# EasyEDA Pro project 轮足机器人主板&核心板.epro, board 卡座主板PCB
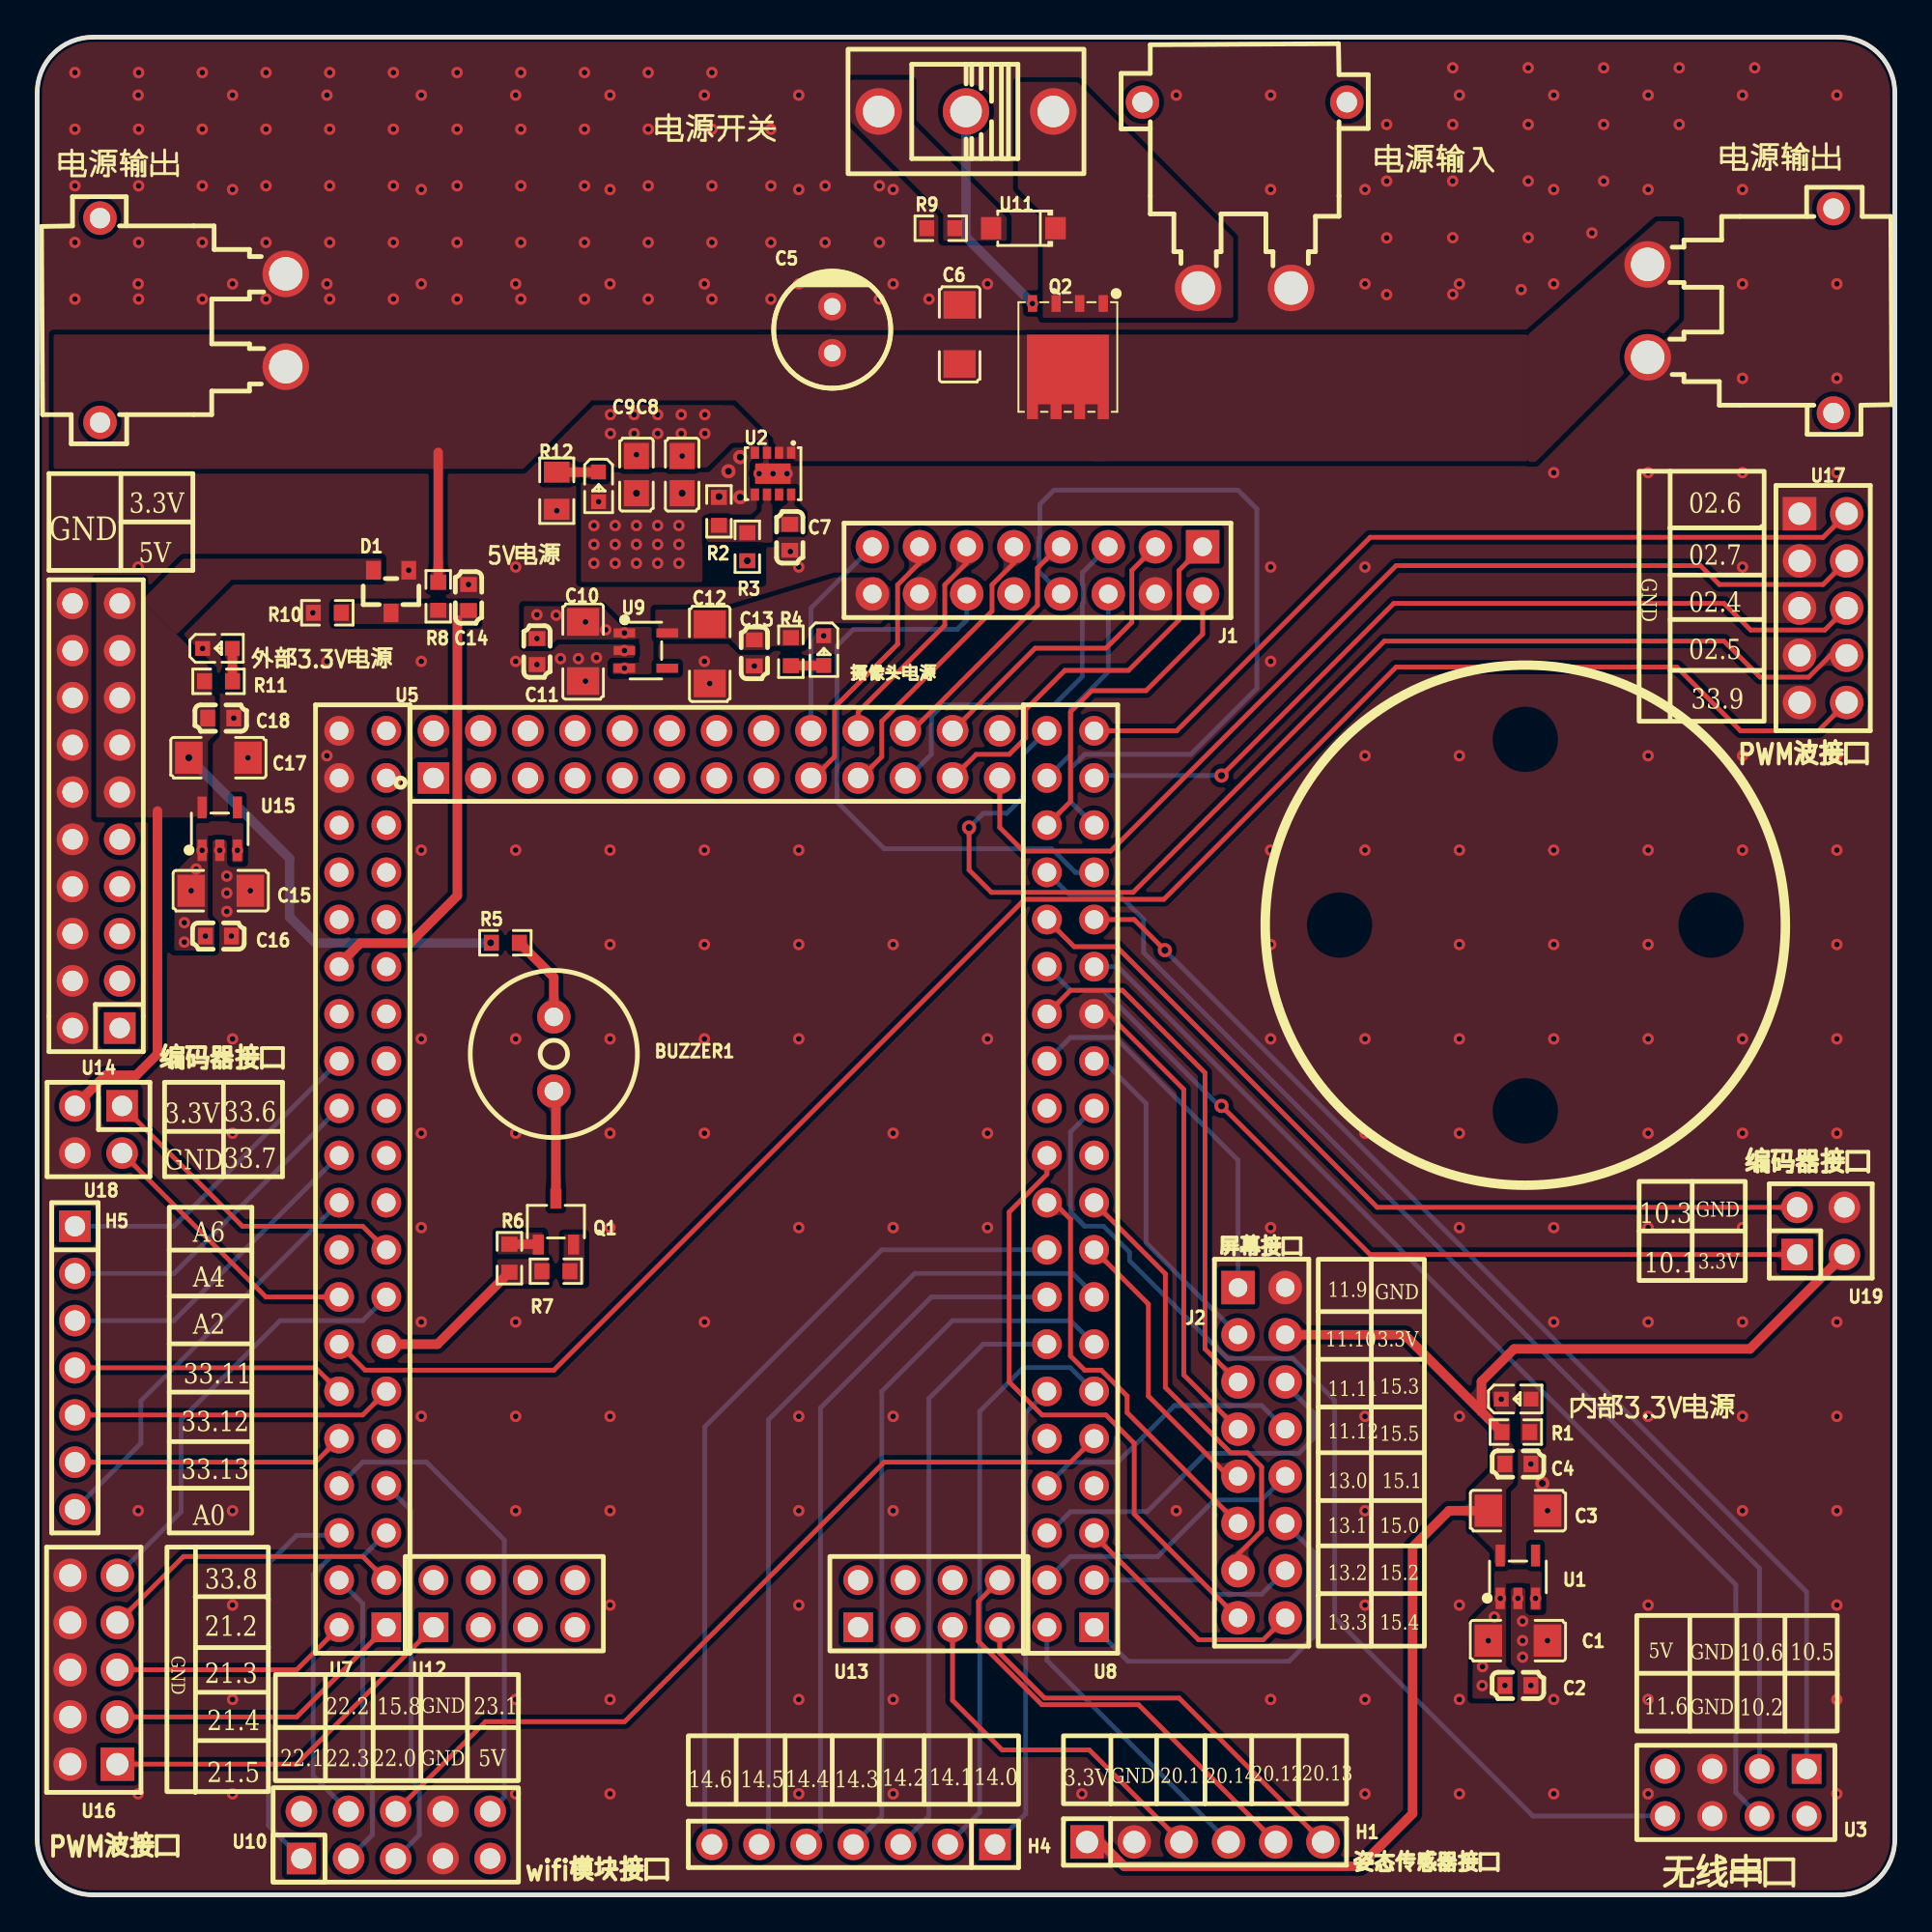
[diagram p13: board, top side]
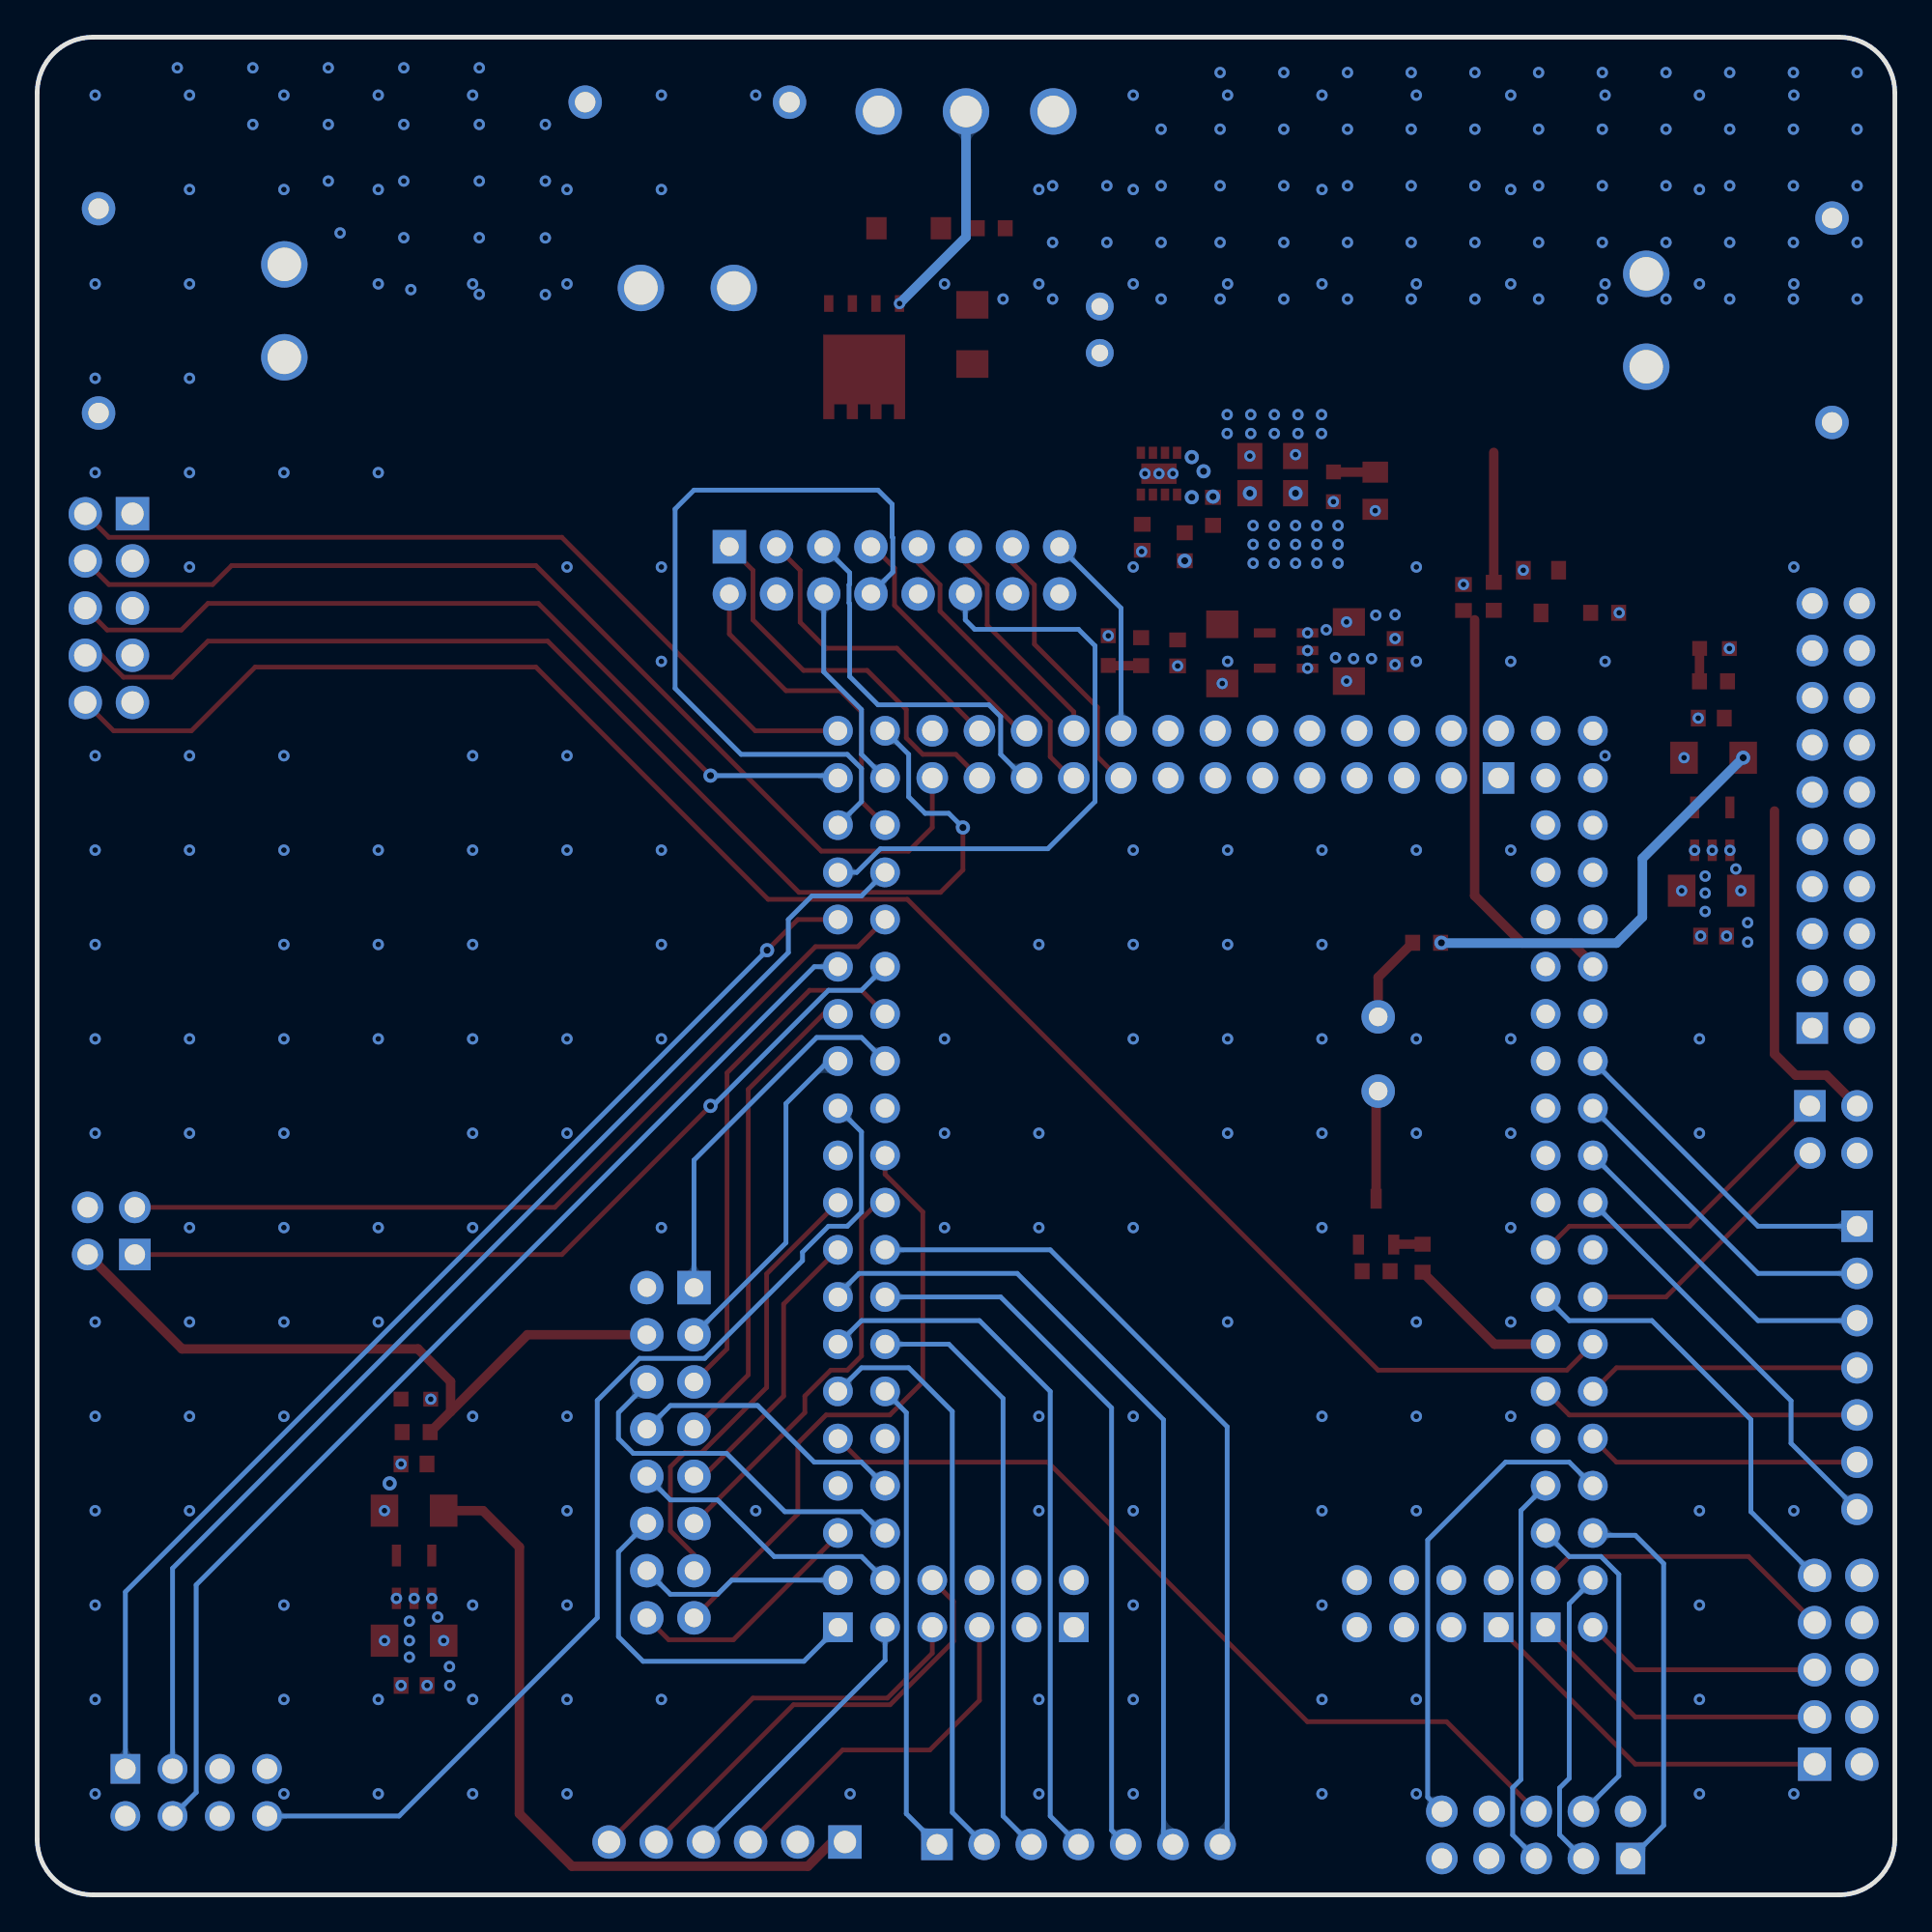
[diagram p14: board, bottom side, seen from below]

Outline 100 x 100 mm; copper layers: Top Layer, Inner1, Inner2, Bottom Layer. Coordinates in mm from the lower left corner of the outline.
Outline path: 0,97 0,3 arc(0.88,0.88) 3,0 97,0 arc(99.12,0.88) 100,3 100,97 arc(99.12,99.12) 97,100 3,100 arc(0.88,99.12) 0,97
Stack: Top Layer 0.035mm 外层铜厚1oz / Dielectric1 0.2104mm 7628 RC49% 8.6mil / Inner1 0.0152mm 内层铜厚 / Dielectric2 1.065mm 1.1mm H/HOZ Copper / Inner2 0.0152mm 内层铜厚 / Dielectric3 0.2104mm 7628 RC49% 8.6mil / Bottom Layer 0.035mm 外层铜厚1oz

## Design rules (mm)
template: 自定义配置
spacing copperThickness1oz (default): track to track 0.102, other pairs 0.152 to 0.3
spacing copperThickness2oz: track to track 0.203, other pairs 0.152 to 0.3
track width copperThickness1oz (default): min 0.127, default 0.254, max 2.54
track width copperThickness2oz: min 0.203, default 0.254, max 2.54
differential pair differentialPair (default): width min 0.127, default 0.254, max 2.54; gap min 0.152, default 0.152
via viaSize (default): diameter min 0.5, default 0.61, max 10; hole min 0.3, default 0.305, max 6.3
net GND uses copperRegion1, innerPlane1
net VIN_BAT uses copperRegion1
net $1N441 uses copperRegion1
net +5V uses copperRegion1, innerPlane1
net VCC3V3 uses copperRegion1
net VCCCAM uses copperRegion1
net $1N1315 uses copperRegion1
net DCIN uses copperRegion1
net $1N1940 uses copperRegion1
net $1N622 uses copperRegion1
net $1N1939 uses copperRegion1
net $1N4417 uses copperRegion1
net $1N4409 uses copperRegion1
net A11 uses copperRegion1
net 33.10 uses copperRegion1
net VCC3V3OUT uses copperRegion1

## Placement (name value [footprint] x y rotation side)
5V电源  -  [LED_0603]  30.23 75.74 270 top
BUZZER1  2.7kHz  [BUZ-TH_BD9.0-P4.00-D0.6-FD]  27.81 45.26 270 top
C1  10uF  [C1206]  79.71 13.68 180 top
C2  100nF  [C0603]  79.71 11.27 180 top
C3  10uF  [C1206]  79.71 20.68 180 top
C4  100nF  [C0603]  79.71 23.19 180 top
C5  150uF  [CAP-TH_BD6.3-P2.50-D0.5-FD]  42.8 84.25 90 top
C6  10uF  [C1206]  49.66 84 270 top
C7  3.3nF  [C0603]  40.51 73.08 90 top
C8  22uF  [C0805]  32.26 76.45 90 top
C9  22uF  [C0805]  34.72 76.45 90 top
C10  10uF  [C1206]  29.39 66.93 90 top
C11  100nF  [C0603]  26.9 66.93 90 top
C12  10uF  [C1206]  36.21 66.8 90 top
C13  100nF  [C0603]  38.61 66.85 90 top
C14  100nF  [C0603]  23.22 69.84 270 top
C15  10uF  [C1206]  9.88 54.05 180 top
C16  100nF  [C0603]  9.76 51.61 180 top
C17  10uF  [C1206]  9.76 61.21 180 top
C18  100nF  [C0603]  9.88 63.34 180 top
D1  BAV99  [SOT-23_L2.9-W1.3-P1.90-LS2.4-BR]  19.05 70.16 90 top
H1  2.54-1x6P直针  [HDR-TH_6P-P2.54-V-M-1]  62.87 2.84 0 top
H4  PZ254V-11-07P  [HDR-TH_7P-P2.54-V-M]  43.94 2.72 180 top
H5  PZ254V-11-07P  [HDR-TH_7P-P2.54-V-M]  2.03 28.37 270 top
J1  2.54-2*8P母  [HDR-TH_16P-P2.54-V-F-R2-C8-S2.54]  53.85 71.3 180 top
J2  2.54-2*8P母  [HDR-TH_16P-P2.54-V-F-R2-C8-S2.54]  65.91 23.8 270 top
Q1  S8050  [SOT-23-3_L2.9-W1.6-P1.90-LS2.8-BR]  27.92 36.24 270 top
Q2  AGM60P100A  [TDSON-8_L5.9-W5.2-P1.27-BL]  55.48 83.89 180 top
R1  2.7k  [R0603]  79.6 24.91 180 top
R2  523kΩ  [R0603]  36.7 74.47 90 top
R3  100kΩ  [R0603]  38.23 72.57 90 top
R4  2.7k  [R0603]  40.57 66.92 90 top
R5  10Ω  [R0603]  25.2 51.25 0 top
R6  4.7kΩ  [R0603]  25.42 34.27 90 top
R7  10K  [R0603]  27.92 33.57 0 top
R8  200k  [R0603]  21.59 69.9 90 top
R9  10k  [R0603]  48.64 89.71 0 top
R10  22k  [R0603]  15.62 69.01 0 top
R11  2.7k  [R0603]  9.76 65.32 180 top
R12  4.7kΩ  [R0805]  27.97 75.58 270 top
U1  RT9013-33GB  [SOT-23-5_L3.0-W1.7-P0.95-LS2.8-BL]  79.71 17.11 0 top
U2  TPS82130SILR  [USIP-8_L3.0-W2.8-P0.65-TL-EP]  39.61 76.5 270 top
U3  2541FV-2x4P  [HDR-TH_8P-P2.54-V-F-R2-C4-S2.54]  91.44 5.51 180 top
U5  PM254-2-13-Z-8.5  [HDR-TH_26P-P2.54-V-F-R2-C13-S2.54-1]  36.58 61.39 0 top
U7  PM254-2-20-Z-8.5  [HDR-TH_40P-P2.54-V-F-R2-C20-S2.54]  17.53 38.53 90 top
U8  PM254-2-20-Z-8.5  [HDR-TH_40P-P2.54-V-F-R2-C20-S2.54]  55.63 38.53 90 top
U9  RT9013-33GB  [SOT-23-5_L3.0-W1.7-P0.95-LS2.8-BL]  32.77 66.98 270 top
U10  2541FV-2x5P  [HDR-TH_10P-P2.54-V-F-R2-C5-S2.54]  19.3 3.23 0 top
U11  BZT52C16  [SOD-123_L2.7-W1.6-LS3.8-RD]  53.09 89.71 180 top
U12  PM254-2-04-Z-8.5  [HDR-TH_8P-P2.54-V-F-R2-C4-S2.54]  25.15 15.67 0 top
U13  PM254-2-04-Z-8.5  [HDR-TH_8P-P2.54-V-F-R2-C4-S2.54]  48.01 15.67 0 top
U14  2541WV-2x10P  [HDR-TH_20P-P2.54-V-M-R2-C10-S2.54]  3.17 58.09 90 top
U15  RT9013-33GB  [SOT-23-5_L3.0-W1.7-P0.95-LS2.8-BL]  9.83 57.38 0 top
U16  A2541WV-2x5P  [HDR-TH_10P-P2.54-V-M-R2-C5-S2.54-1]  3.05 12.12 90 top
U17  A2541WV-2x5P  [HDR-TH_10P-P2.54-V-M-R2-C5-S2.54-1]  96.14 69.27 270 top
U18  KH-2.54PH180-2X2P-L11.5  [HDR-TH_4P-P2.54-V-M-R2-C2-S2.54]  3.3 41.2 180 top
U19  KH-2.54PH180-2X2P-L11.5  [HDR-TH_4P-P2.54-V-M-R2-C2-S2.54]  96.01 35.74 0 top
内部3.3V电源  -  [LED_0603]  79.66 26.69 0 top
外部3.3V电源  -  [LED_0603]  9.76 67.1 0 top
摄像头电源  -  [LED_0603]  42.35 66.93 270 top
电源开关  SS-12D10L3  [SW-TH_SS-12D10L3]  50 96 180 top
电源输入  XT30PW-M30.G.Y  [CONN-TH_XT30PW-M]  65 91.5 180 top
电源输出  -  [CONN-TH_XT30PW-M]  8.38 84.76 270 top
电源输出#2  -  [CONN-TH_XT30PW-M]  91.69 85.27 90 top

## Footprints (pads in the part's own frame, mm; a bottom-side part is the same pattern mirrored in y, then rotated)
BUZ-TH_BD9.0-P4.00-D0.6-FD
  round 1.8 hole 1: 1(-2,0) 2(2,0)
C0603
  rect 0.8x0.9 smd: 1(-0.7,0) 2(0.7,0)
C0805
  rect 1.41x1.35 smd: 1(-1,0) 2(1,0)
C1206
  rect 1.485x1.728 smd: 1(-1.593,0) 2(1.593,0)
CAP-TH_BD6.3-P2.50-D0.5-FD
  round 1.5 hole 0.9: 1(-1.25,0) 2(1.25,0)
CONN-TH_XT30PW-M
  round 2.5 hole 1.8: 1(-2.5,5) 2(2.5,5)
  round 1.8 hole 1.1: 3(5.5,-5) 4(-5.5,-5)
HDR-TH_4P-P2.54-V-M-R2-C2-S2.54
  rect 1.7x1.7 hole 1.1: 1(-1.27,-1.27)
  round 1.7 hole 1.1: 2(-1.27,1.27) 3(1.27,-1.27) 4(1.27,1.27)
HDR-TH_6P-P2.54-V-M-1
  rect 1.8x1.8 hole 1.2: 1(-6.35,0)
  round 1.8 hole 1.2: 2(-3.81,0) 3(-1.27,0) 4(1.27,0) 5(3.81,0) 6(6.35,0)
HDR-TH_7P-P2.54-V-M
  rect 1.7x1.7 hole 1.1: 1(-7.62,0)
  round 1.7 hole 1.1: 2(-5.08,0) 3(-2.54,0) 4(0,0) 5(2.54,0) 6(5.08,0) 7(7.62,0)
HDR-TH_8P-P2.54-V-F-R2-C4-S2.54
  rect 1.6x1.6 hole 1.1: 1(-3.81,-1.27)
  round 1.6 hole 1.1: 2(-3.81,1.27) 3(-1.27,-1.27) 4(-1.27,1.27) 5(1.27,-1.27) 6(1.27,1.27) 7(3.81,-1.27) 8(3.81,1.27)
HDR-TH_10P-P2.54-V-F-R2-C5-S2.54
  rect 1.575x1.7 hole 1.1: 1(-5.08,-1.27)
  round 1.7 hole 1.1: 2(-5.08,1.27) 3(-2.54,-1.27) 4(-2.54,1.27) 5(0,-1.27) 6(0,1.27) 7(2.54,-1.27) 8(2.54,1.27) 9(5.08,-1.27) 10(5.08,1.27)
HDR-TH_10P-P2.54-V-M-R2-C5-S2.54-1
  rect 1.8x1.8 hole 1.2: 1(-5.08,-1.27)
  round 1.8 hole 1.2: 2(-5.08,1.27) 3(-2.54,-1.27) 4(-2.54,1.27) 5(0,-1.27) 6(0,1.27) 7(2.54,-1.27) 8(2.54,1.27) 9(5.08,-1.27) 10(5.08,1.27)
HDR-TH_16P-P2.54-V-F-R2-C8-S2.54
  rect 1.8x1.8 hole 1: 1(-8.89,-1.27)
  round 1.8 hole 1: 2(-8.89,1.27) 3(-6.35,-1.27) 4(-6.35,1.27) 5(-3.81,-1.27) 6(-3.81,1.27) 7(-1.27,-1.27) 8(-1.27,1.27) 9(1.27,-1.27) 10(1.27,1.27) 11(3.81,-1.27) 12(3.81,1.27) 13(6.35,-1.27) 14(6.35,1.27) 15(8.89,-1.27) 16(8.89,1.27)
HDR-TH_20P-P2.54-V-M-R2-C10-S2.54
  rect 1.7x1.7 hole 1.1: 1(-11.43,-1.27)
  round 1.7 hole 1.1: 2(-11.43,1.27) 3(-8.89,-1.27) 4(-8.89,1.27) 5(-6.35,-1.27) 6(-6.35,1.27) 7(-3.81,-1.27) 8(-3.81,1.27) 9(-1.27,-1.27) 10(-1.27,1.27) 11(1.27,-1.27) 12(1.27,1.27) 13(3.81,-1.27) 14(3.81,1.27) 15(6.35,-1.27) 16(6.35,1.27) 17(8.89,-1.27) 18(8.89,1.27) 19(11.43,-1.27) 20(11.43,1.27)
HDR-TH_26P-P2.54-V-F-R2-C13-S2.54-1
  rect 1.7x1.7 hole 1.1: 1(-15.24,-1.27)
  round 1.7 hole 1.1: 2(-15.24,1.27) 3(-12.7,-1.27) 4(-12.7,1.27) 5(-10.16,-1.27) 6(-10.16,1.27) 7(-7.62,-1.27) 8(-7.62,1.27) 9(-5.08,-1.27) 10(-5.08,1.27) 11(-2.54,-1.27) 12(-2.54,1.27) 13(0,-1.27) 14(0,1.27) 15(2.54,-1.27) 16(2.54,1.27) 17(5.08,-1.27) 18(5.08,1.27) 19(7.62,-1.27) 20(7.62,1.27) 21(10.16,-1.27) 22(10.16,1.27) 23(12.7,-1.27) 24(12.7,1.27) 25(15.24,-1.27) 26(15.24,1.27)
HDR-TH_40P-P2.54-V-F-R2-C20-S2.54
  rect 1.6x1.6 hole 1: 1(-24.13,-1.27)
  round 1.6 hole 1: 2(-24.13,1.27) 3(-21.59,-1.27) 4(-21.59,1.27) 5(-19.05,-1.27) 6(-19.05,1.27) 7(-16.51,-1.27) 8(-16.51,1.27) 9(-13.97,-1.27) 10(-13.97,1.27) 11(-11.43,-1.27) 12(-11.43,1.27) 13(-8.89,-1.27) 14(-8.89,1.27) 15(-6.35,-1.27) 16(-6.35,1.27) 17(-3.81,-1.27) 18(-3.81,1.27) 19(-1.27,-1.27) 20(-1.27,1.27) 21(1.27,-1.27) 22(1.27,1.27) 23(3.81,-1.27) 24(3.81,1.27) 25(6.35,-1.27) 26(6.35,1.27) 27(8.89,-1.27) 28(8.89,1.27) 29(11.43,-1.27) 30(11.43,1.27) 31(13.97,-1.27) 32(13.97,1.27) 33(16.51,-1.27) 34(16.51,1.27) 35(19.05,-1.27) 36(19.05,1.27) 37(21.59,-1.27) 38(21.59,1.27) 39(24.13,-1.27) 40(24.13,1.27)
LED_0603
  rect 0.8x0.8 smd: 1(-0.851,-0.01) 2(0.75,-0.005)
R0603
  rect 0.806x0.864 smd: 1(-0.753,0) 2(0.753,0)
R0805
  rect 1.133x1.377 smd: 1(-1,0) 2(1,0)
SOD-123_L2.7-W1.6-LS3.8-RD
  rect 1.1x1.2 smd: 1(-1.735,0) 2(1.735,0)
SOT-23-3_L2.9-W1.6-P1.90-LS2.8-BR
  rect 1.07x0.6 smd: 1(1.235,-0.95) 2(1.235,0.95) 3(-1.235,0)
SOT-23-5_L3.0-W1.7-P0.95-LS2.8-BL
  rect 0.49x1.157 smd: 1(-0.95,-1.153) 2(0,-1.153) 3(0.95,-1.153)
  rect 0.49x1.175 smd: 4(0.95,1.153) 5(-0.95,1.153)
SOT-23_L2.9-W1.3-P1.90-LS2.4-BR
  rect 1x0.8 smd: 1(1.15,-0.95) 2(1.15,0.95) 3(-1.15,0)
SW-TH_SS-12D10L3
  round 2.5 hole 1.7: 1(-4.7,0) 2(0,0) 3(4.7,0)
TDSON-8_L5.9-W5.2-P1.27-BL
  rect 0.5x0.9 smd: 1(-1.905,-1.775) 2(-0.635,-1.775) 3(0.635,-1.775) 4(1.905,-1.775)
  custom 4.41x4.55 smd: 5(0,1.775)
USIP-8_L3.0-W2.8-P0.65-TL-EP
  rect 0.65x0.45 smd: 1(-1.125,0.975) 2(-1.125,0.325) 3(-1.125,-0.325) 4(-1.125,-0.975) 5(1.125,-0.975) 6(1.125,-0.325) 7(1.125,0.325) 8(1.125,0.975)
  rect 1.1x1.9 smd: 9(0,0)

## Nets
As in the schematic, except:
+5V: 5V电源.2 C1.2 C2.2 C8.1 C9.1 C10.2 C11.2 C15.2 C16.2 R2.2 U1.1 U1.3 U2.4 U2.5 U3.7 U7.37 U7.39 U9.1 U9.3 U10.9 U14.1 U14.3 U14.5 U14.7 U14.9 U15.1 U15.3
GND: C1.1 C2.1 C3.1 C4.1 C5.2 C6.1 C7.1 C8.2 C9.2 C10.1 C11.1 C12.1 C13.1 C14.1 C15.1 C16.1 C17.1 C18.1 D1.1 H1.2 J1.4 J1.14 J2.2 R3.1 R9.1 R10.1 R12.2 U1.2 U2.3 U2.9 U3.5 U3.6 U7.38 U7.40 U9.2 U10.7 U10.8 U14.2 U14.4 U14.6 U14.8 U14.10 U14.12 U14.14 U14.16 U14.18 U14.20 U15.2 U16.2 U16.4 U16.6 U16.8 U16.10 U17.1 U17.3 U17.5 U17.7 U17.9 U18.4 U19.4 内部3.3V电源.1 外部3.3V电源.1 摄像头电源.1 电源输入.1 电源输出.1 电源输出#2.1
VIN_BAT: C5.1 C6.2 Q2.5 R8.2 U2.1 U2.2 电源输出.2 电源输出#2.2
DCIN: Q2.1 Q2.2 Q2.3 U11.1 电源开关.1 电源输入.2
$1N1315: R1.1 内部3.3V电源.2
$1N1610: R4.1 摄像头电源.2
$1N1939: R9.2 U11.2 电源开关.3
$1N1940: Q2.4 电源开关.2
$1N16381: R11.1 外部3.3V电源.2
$1N16988: 5V电源.1 R12.1

Pads without a net: J1 10; U1 4; U2 7; U3 2; U9 4; U10 2; U15 4; 电源输入 3 4; 电源输出 3 4; 电源输出#2 3 4

## Via types
v1: diameter 0.61, hole 0.305, Top Layer to Bottom Layer, 348 vias
v2: diameter 0.762, hole 0.381, Top Layer to Bottom Layer, 14 vias

## Routing (per net, layer and track width the routed paths; a pad name or vN(x,y) marks a point on that pad's centre or on a via; arc(x,y) is an arc through that point)
+5V:
  vias: v1(7.92,52.33) v1(7.92,51.28) v1(8.29,54.05) v1(8.56,55.22) v1(8.88,56.23) v1(9.06,51.61) v1(10.78,56.23) v1(26.9,68.91) v1(26.9,67.63) v1(27.94,68.89) v1(29.52,68.52) v1(29.97,73.71) v1(29.97,72.69) v1(29.97,71.68) v1(30.22,75) v1(30.61,68.1) v1(31.12,73.71) v1(31.12,72.69) v1(31.12,71.68) v1(31.61,67.93) v1(31.61,66.03) v1(32.26,73.71) v1(32.26,72.69) v1(32.26,71.68) v1(33.4,73.71) v1(33.4,72.69) v1(33.4,71.68) v1(34.54,73.71) v1(34.54,72.69) v1(34.54,71.68) v1(77.8,12.29) v1(77.79,11.27) v1(78.12,13.68) v1(78.44,14.95) v1(78.76,15.96) v1(79.01,11.27) v1(80.66,15.96) v2(32.26,75.45) v2(34.72,75.45) v2(36.7,75.27) v2(37.21,76.63) v2(37.85,77.39) v2(37.85,75.23)
GND:
  vias: v1(2.03,98.09) v1(2.03,95.05) v1(2.03,92) v1(2.03,88.95) v1(2.03,85.9) v1(5.44,96.88) v1(5.44,86.72) v1(5.44,71.48) v1(5.44,20.68) v1(5.44,5.44) v1(5.46,98.09) v1(5.46,95.05) v1(5.46,92) v1(5.46,88.95) v1(5.46,85.9) v1(8.89,98.09) v1(8.89,95.05) v1(8.89,92) v1(8.89,88.95) v1(8.89,85.9) v1(8.91,67.09) v1(9.83,56.23) v1(10.21,54.84) v1(10.21,53.92) v1(10.21,52.94) v1(10.52,96.88) v1(10.52,91.8) v1(10.52,86.72) v1(10.46,51.61) v1(10.52,46.08) v1(10.52,41) v1(10.52,20.68) v1(10.52,15.6) v1(10.52,10.52) v1(10.52,5.44) v1(10.58,63.34) v1(11.35,61.21) v1(11.47,54.05) v1(12.32,98.09) v1(12.32,95.05) v1(12.32,92) v1(12.32,88.95) v1(12.32,85.9) v1(14.84,69.01) v1(15.6,96.88) v1(15.6,86.72) v1(15.6,66.4) v1(15.6,61.32) v1(15.75,98.09) v1(15.75,95.05) v1(15.75,92) v1(15.75,88.95) v1(15.75,85.9) v1(19.18,98.09) v1(19.18,95.05) v1(19.18,92) v1(19.18,88.95) v1(19.18,85.9) v1(20,71.31) v1(20.68,96.88) v1(20.68,91.8) v1(20.68,86.72) v1(20.68,66.4) v1(20.68,56.24) v1(20.68,46.08) v1(20.68,41) v1(20.68,35.92) v1(20.68,30.84) v1(20.68,25.76) v1(22.61,98.09) v1(22.61,95.05) v1(22.61,92) v1(22.61,88.95) v1(22.61,85.9) v1(23.22,70.54) v1(25.76,96.88) v1(25.76,86.72) v1(25.76,71.48) v1(25.76,66.4) v1(25.76,56.24) v1(25.76,46.08) v1(25.76,41) v1(25.76,30.84) v1(25.76,25.76) v1(25.76,20.68) v1(25.76,10.52) v1(25.76,5.44) v1(26.03,98.09) v1(26.03,95.05) v1(26.03,92) v1(26.03,88.95) v1(26.03,85.9) v1(26.9,66.23) v1(27.97,74.51) v1(28.17,66.55) v1(29.13,66.55) v1(29.46,98.09) v1(29.46,95.05) v1(29.46,92) v1(29.46,88.95) v1(29.46,85.9) v1(29.52,65.33) v1(30.11,66.6) v1(30.84,96.88) v1(30.84,91.8) v1(30.84,86.72) v1(30.84,56.24) v1(30.84,51.16) v1(30.84,46.08) v1(30.84,41) v1(30.84,35.92) v1(30.84,25.76) v1(30.84,20.68) v1(30.84,15.6) v1(30.84,10.52) v1(30.84,5.44) v1(30.86,79.68) v1(30.86,78.66) v1(31.61,66.98) v1(32.13,79.68) v1(32.13,78.66) v1(32.26,77.53) v1(32.89,98.09) v1(32.89,95.05) v1(32.89,92) v1(32.89,88.95) v1(32.89,85.9) v1(33.4,79.68) v1(33.4,78.66) v1(34.67,79.68) v1(34.67,78.66) v1(34.72,77.45) v1(35.92,96.88) v1(35.92,86.72) v1(35.94,79.68) v1(35.94,78.66) v1(35.92,66.4) v1(35.92,56.24) v1(35.92,51.16) v1(35.92,46.08) v1(35.92,41) v1(35.92,30.84) v1(36.21,65.21) v1(36.32,98.09) v1(36.32,95.05) v1(36.32,92) v1(36.32,88.95) v1(36.32,85.9) v1(38.61,66.15) v1(38.86,76.5) v1(39.5,95.05) v1(39.5,92) v1(39.5,88.95) v1(39.5,85.9) v1(39.61,76.5) v1(40.37,76.5) v1(40.54,72.31) v1(41,96.88) v1(41,91.8) v1(41,86.72) v1(41,71.48) v1(41,56.24) v1(41,51.16) v1(41,46.08) v1(41,35.92) v1(41,25.76) v1(41,20.68) v1(41,15.6) v1(41,10.52) v1(41,5.44) v1(42.34,67.78) v1(42.42,92) v1(42.42,88.95) v1(45.34,92) v1(45.34,88.95) v1(45.34,85.9) v1(46.08,91.8) v1(46.08,86.72) v1(46.08,51.16) v1(46.08,41) v1(46.08,35.92) v1(46.08,25.76) v1(46.08,20.68) v1(46.08,10.52) v1(46.08,5.44) v1(48.01,85.9) v1(51.16,86.72) v1(51.16,46.08) v1(51.16,41) v1(51.16,35.92) v1(56.24,5.44) v1(61.32,96.88) v1(61.32,20.68) v1(66.4,96.88) v1(66.4,91.8) v1(66.4,71.48) v1(66.4,66.4) v1(66.4,56.24) v1(66.4,51.16) v1(66.4,46.08) v1(66.4,35.92) v1(66.4,10.52) v1(71.48,91.8) v1(71.48,86.72) v1(71.48,71.48) v1(71.48,61.32) v1(71.48,56.24) v1(71.48,46.08) v1(71.48,41) v1(71.48,25.76) v1(71.48,20.68) v1(71.48,15.6) v1(71.48,10.52) v1(71.48,5.44) v1(72.64,95.3) v1(72.64,92.25) v1(72.64,89.19) v1(72.64,86.14) v1(76.2,98.35) v1(76.2,95.3) v1(76.2,92.25) v1(76.2,89.2) v1(76.2,86.16) v1(76.56,96.88) v1(76.56,86.72) v1(76.56,61.32) v1(76.56,56.24) v1(76.56,51.16) v1(76.56,46.08) v1(76.56,41) v1(76.56,35.92) v1(76.56,25.76) v1(76.56,15.6) v1(76.56,10.52) v1(76.56,5.44) v1(78.81,26.68) v1(79.71,15.96) v1(79.88,86.41) v1(79.96,14.73) v1(79.96,13.68) v1(79.96,12.79) v1(80.26,98.35) v1(80.26,95.3) v1(80.26,92.25) v1(80.26,89.2) v1(80.41,23.19) v1(80.41,11.27) v1(81.3,20.68) v1(81.3,13.68) v1(81.64,96.88) v1(81.64,91.8) v1(81.64,86.72) v1(81.64,76.56) v1(81.64,56.24) v1(81.64,51.16) v1(81.64,46.08) v1(81.64,35.92) v1(81.64,30.84) v1(81.64,10.52) v1(81.64,5.44) v1(83.69,89.46) v1(84.33,98.35) v1(84.33,95.3) v1(84.33,92.25) v1(86.72,96.88) v1(86.72,91.8) v1(86.72,76.56) v1(86.72,61.32) v1(86.72,56.24) v1(86.72,51.16) v1(86.72,46.08) v1(86.72,41) v1(86.72,35.92) v1(86.72,30.84) v1(86.72,25.76) v1(86.72,15.6) v1(86.72,10.52) v1(86.72,5.44) v1(88.39,98.35) v1(88.39,95.3) v1(91.8,96.88) v1(91.8,91.8) v1(91.8,86.72) v1(91.8,81.64) v1(91.8,76.56) v1(91.8,71.48) v1(91.8,61.32) v1(91.8,56.24) v1(91.8,46.08) v1(91.8,41) v1(91.8,35.92) v1(91.8,30.84) v1(91.8,25.76) v1(91.8,20.68) v1(92.46,98.35) v1(96.88,96.88) v1(96.88,86.72) v1(96.88,81.64) v1(96.88,76.56) v1(96.88,61.32) v1(96.88,56.24) v1(96.88,51.16) v1(96.88,46.08) v1(96.88,41) v1(96.88,30.84) v1(96.88,25.76) v1(96.88,20.68) v1(96.88,15.6) v1(96.88,10.52) v1(96.88,5.44) v2(38.23,71.81) v2(81.03,22.15)
VCC3V3: length 76.3
  Top Layer w0.508: 77.75,26.01 73.6,30.15 J2.4 ; 77.75,26.01 R1.2 ; 77.75,26.01 77.75,27.63 79.5,29.39 92.2,29.39 U19.3 ; H1.1 57.21,2.84 58.51,1.54 71.21,1.54 74.04,4.37 74.04,18.72 76,20.68 C3.2
VCC3V3OUT: length 40.9
  Top Layer w0.508: U18.3 3.68,44.12 5.33,44.12 6.48,45.26 6.48,58.34
  Bottom Layer w0.508: v2(24.41,51.25) 24.39,51.23 14.99,51.23 13.59,52.63 13.59,55.79 v2(8.16,61.21)
VIN_BAT: length 7
  Top Layer w0.508: R8.2 21.59,77.65
00.0: length 21.1
  Top Layer w0.254: J1.1 61.47,71.3 61.47,68.63 58.75,65.91 55.32,65.91 53.21,63.81 53.21,62.28 52.32,61.39 50.55,61.39 U5.23
00.1: length 16.7
  Top Layer w0.254: U5.24 53.72,67.11 57.53,67.11 58.93,68.5 58.93,71.3 J1.3
00.2: length 20.6
  Bottom Layer w0.254: J1.5 56.26,71.17 56.26,70.55 56.3,70.52 56.3,69.54 56.26,69.5 56.26,65.58 54.74,64.06 48.77,64.06 48.13,63.42 48.13,61.39 46.86,60.12 U5.21
00.3: length 13.7
  Top Layer w0.254: U5.22 47.09,62.66 53.85,69.42 53.85,71.42 54.99,72.57 J1.7
00.4: length 16
  Top Layer w0.254: U5.19 44.32,60.12 45.47,61.27 45.47,63.17 51.4,69.1 51.4,70.52 52.58,71.7 J1.9
00.5: length 12.3
  Top Layer w0.254: U5.20 44.2,63.68 48.86,68.34 48.86,70.52 50.04,71.7 J1.11
00.6: length 14.9
  Top Layer w0.254: J1.13 47.5,71.7 46.32,70.52 46.32,67.33 42.93,63.93 42.93,61.27 41.78,60.12 U5.17
00.7: length 11.3
  Bottom Layer w0.254: U5.18 41.66,69.27 J1.15
02.0: length 32.8
  Bottom Layer w0.254: U8.33 55.88,55.04 54.61,56.31 45.59,56.31 43.05,58.85 43.05,67.23 43.94,68.12 49.53,68.12 50.04,68.63 J1.12
02.1: length 17.6
  Top Layer w0.254: J1.2 62.74,67.87 59.69,64.82 56.77,64.82 55.63,63.68 55.63,58.85 U8.36
02.2: length 42.8
  Bottom Layer w0.254: U8.35 55.63,58.85 55.63,60.63 56.39,61.39 62.1,61.39 65.66,64.95 65.66,74.6 64.64,75.62 54.74,75.62 53.97,74.85 53.97,73.09 53.94,73.06 53.94,71.21 J1.8
02.3: length 11.3
  Bottom Layer w0.254: J1.6 57.66,65.84 55.63,63.81 55.63,61.39 U8.38
02.4: length 45.5
  Top Layer w0.254: 97.41,69.27 96.23,68.09 92.24,68.09 90.81,69.52 73.03,69.52 v2(63.75,60.25)
  Bottom Layer w0.254: v2(63.75,60.25) 57.02,60.25 U8.37
02.5: length 64.6
  Top Layer w0.254: 97.41,66.73 96.54,66.73 95.36,65.55 92.75,65.55 90.81,67.49 72.52,67.49 58.99,53.96 51.37,53.96 50.16,55.17 v2(50.16,57.45)
  Bottom Layer w0.254: v2(50.16,57.45) 50.93,58.22 52.2,58.22 53.09,59.11 53.09,61.39 U8.40
02.6: length 45.4
  Top Layer w0.254: U8.39 61.34,62.66 71.75,73.08 96.14,73.08 97.41,74.35
02.7: length 56.1
  Top Layer w0.254: 97.41,71.81 96.14,70.54 90.55,70.54 89.53,71.55 73.15,71.55 57.78,56.19 53.09,56.19 51.82,57.45 U5.25
10.1: length 46.8
  Top Layer w0.254: U19.1 71.75,34.47 v2(63.75,42.47)
  Bottom Layer w0.254: v2(63.75,42.47) 63.63,42.47 57.4,48.69 55.63,48.69 U8.30
10.2: length 61.3
  Bottom Layer w0.254: U3.4 91.44,5.51 91.44,16.69 58.17,49.96 U8.29
10.3: length 46.8
  Top Layer w0.254: U19.2 72.14,37.01 58.1,51.04 55.82,51.04 U8.32
10.5: length 62.9
  Top Layer w0.254: U8.31 59.06,52.5 v2(60.71,50.85)
  Bottom Layer w0.254: U3.1 95.25,16.31 v2(60.71,50.85)
10.6: length 65.7
  Bottom Layer w0.254: U3.3 92.71,17.58 59.56,50.72 59.56,52.5 58.29,53.77 55.63,53.77 U8.34
11.6: length 58.7
  Bottom Layer w0.254: U8.23 55.63,41.07 55.63,36.75 56.39,35.99 57.4,35.99 58.8,34.59 58.8,34.14 64.06,28.88 67.58,28.88 69.85,26.61 69.85,14.91 80.52,4.24 U3.8
11.9: length 20.4
  Bottom Layer w0.254: U8.26 55.63,46.15 58.04,46.15 64.64,39.55 J2.1
11.10: length 18.2
  Bottom Layer w0.254: U8.25 57.4,44.88 59.69,42.6 59.69,35.1 J2.3
11.11: length 28.2
  Top Layer w0.254: J2.5 62.87,29.39 62.87,44.25 58.42,48.69 55.63,48.69 U8.28
11.12: length 26
  Top Layer w0.254: U8.27 57.66,47.42 61.72,43.36 61.72,27.99 J2.7
13.0: length 15.7
  Top Layer w0.254: U8.17 59.82,31.8 59.82,26.85 64.13,22.53 J2.9
13.1: length 22.3
  Top Layer w0.254: U8.20 54.74,37.26 55.63,36.37 55.63,29.01 56.39,28.25 57.28,28.25 58.67,26.85 58.67,25.96 J2.11
13.2: length 24.6
  Top Layer w0.254: J2.13 64.64,18.32 65.91,19.59 65.91,23.04 65.15,23.8 64.25,23.8 60.73,27.31 60.73,33.43 U8.19
13.3: length 32.8
  Top Layer w0.254: J2.15 59.06,20.5 59.06,24.31 57.53,25.83 54.1,25.83 52.32,27.61 52.32,36.76 54.36,38.79 U8.22
14.0: length 25.5
  Bottom Layer w0.254: U8.12 53.21,25.96 53.21,4.37 H4.1
14.1: length 31.7
  Bottom Layer w0.254: U8.11 55.63,28.37 53.09,28.37 50.74,26.02 50.74,4.43 H4.2
14.2: length 32.2
  Bottom Layer w0.254: H4.3 48.01,4.24 48.01,26.72 50.93,29.64 U8.14
14.3: length 38.5
  Bottom Layer w0.254: H4.4 45.47,4.24 45.47,27.1 49.28,30.91 55.63,30.91 U8.13
14.4: length 38.5
  Bottom Layer w0.254: U8.16 48.13,32.18 42.16,26.21 42.16,3.48 H4.5
14.5: length 44.5
  Bottom Layer w0.254: U8.15 56.9,32.31 55.75,33.45 47.24,33.45 39.37,25.58 39.37,3.23 H4.6
14.6: length 45
  Bottom Layer w0.254: U8.18 45.47,34.72 35.94,25.2 35.94,3.1 H4.7
15.0: length 19.8
  Bottom Layer w0.254: U8.1 58.73,12.57 67.38,12.57 68.71,13.89 68.71,18.47 J2.12
15.1: length 15.1
  Bottom Layer w0.254: J2.10 65.91,21.26 63.37,21.26 60.32,18.21 55.63,18.21 U8.4
15.2: length 11.1
  Bottom Layer w0.254: J2.14 65.91,16.18 63.37,16.18 62.61,16.94 U8.3
15.3: length 20.1
  Bottom Layer w0.254: U8.6 54.48,19.48 55.63,20.62 59.75,20.62 62.89,23.76 67.91,23.76 68.71,24.56 68.71,25.96 67.18,27.48 J2.6
15.4: length 13.2
  Top Layer w0.254: J2.16 66,13.73 62.52,13.73 56.9,19.35 U8.5
15.5: length 15.1
  Bottom Layer w0.254: U8.8 55.63,23.29 58.17,23.29 61.21,26.34 65.91,26.34 J2.8
15.8: length 45.9
  Top Layer w0.254: U8.9 55.63,23.29 45.59,23.29 31.62,9.32 24.13,9.32 U10.6
20.11: length 19.4
  Top Layer w0.254: H1.3 56.64,7.8 51.94,7.8 49.28,10.47 U13.5
20.12: length 24.2
  Top Layer w0.254: U13.8 50.67,15.8 50.67,13.64 54.08,10.24 59.28,10.24 H1.5
20.13: length 23
  Top Layer w0.254: U13.7 51.82,13 54.23,10.59 61.47,10.59 H1.6
20.14: length 15.6
  Bottom Layer w0.254: U8.2 54.36,12.62 H1.4
21.2: length 16.5
  Top Layer w0.254: U16.7 7.87,18.21 17.53,18.21 U7.3
21.3: length 12.9
  Top Layer w0.254: U7.2 13.97,12.12 U16.5
21.4: length 16.5
  Top Layer w0.254: U7.1 13.97,9.58 U16.3
21.5: length 20.1
  Top Layer w0.254: U16.1 13.97,7.04 U12.1
22.0: length 21.3
  Bottom Layer w0.254: U7.7 20.13,20.69 20.13,6.21 20.57,5.77 20.57,3.23 U10.5
22.1: length 21.1
  Bottom Layer w0.254: U7.6 16.13,19.35 13.97,19.35 12.45,17.83 12.45,3.73 U10.1
22.2: length 18.4
  Bottom Layer w0.254: U10.4 14.86,6.4 14.86,17.25 15.82,18.21 17.53,18.21 U7.5
22.3: length 16.3
  Bottom Layer w0.254: U7.4 17.53,15.67 17.53,6.27 18.05,5.75 18.05,3.24 U10.3
23.1: length 26.1
  Bottom Layer w0.254: U7.8 17.53,23.29 20.95,23.29 25.15,19.1 25.15,5.26 U10.10
33.6: length 17.4
  Top Layer w0.254: U7.17 17.53,35.99 11.05,35.99 U18.1
33.7: length 14.9
  Top Layer w0.254: U7.16 12.32,32.18 U18.2
33.8: length 23.6
  Bottom Layer w0.254: U16.9 7.75,20.62 7.75,25.58 13.08,30.91 17.53,30.91 U7.15
33.9: length 99.5
  Top Layer w0.254: 97.41,64.19 95.88,62.66 91.69,62.66 88.26,66.09 73.15,66.09 60.65,53.59 53.16,53.59 27.81,28.25 17.65,28.25 U7.14
33.10: length 8.2
  Top Layer w0.508: U7.13 21.55,29.64 R6.1
33.11: length 14.8
  Top Layer w0.254: H5.4 14.99,28.37 U7.12
33.12: length 17.3
  Top Layer w0.254: H5.5 17.53,25.83 U7.11
33.13: length 14.8
  Top Layer w0.254: H5.6 14.99,23.29 U7.10
A0: length 22.4
  Bottom Layer w0.254: H5.7 5.59,24.31 5.59,26.59 U7.20
A2: length 17.9
  Bottom Layer w0.254: U7.22 7.37,30.91 H5.3
A4: length 17.9
  Bottom Layer w0.254: H5.2 7.37,33.45 U7.24
A6: length 17.9
  Bottom Layer w0.254: U7.26 7.37,35.99 H5.1
A11: length 22.9
  Top Layer w0.508: U7.30 16.26,50.09 17.4,51.23 20.07,51.23 22.62,53.79 22.62,68.64
$1N441: length 0.1
  Top Layer w0.254: 40.59,73.85 C7.2
$1N1610: length 1.8
  Top Layer w0.508: 摄像头电源.2 42.33,66.17 R4.1
$1N1940: length 11.8
  Bottom Layer w0.508: 电源开关.2 50,89.24 v1(53.58,85.66)
$1N4414: length 5.8
  Top Layer w0.508: BUZZER1.2 27.92,43.15 Q1.3
$1N4417: length 1.6
  Top Layer w0.508: R6.2 26.95,35.02 26.97,35
$1N4508: length 4.8
  Top Layer w0.508: BUZZER1.1 27.81,49.39 25.96,51.25
$1N16381: length 1.8
  Top Layer w0.508: 10.51,67.1 10.52,67.09 R11.1
$1N16988: length 2.2
  Top Layer w0.508: 5V电源.1 30.21,76.58 R12.1

## Copper pours and planes (outline as drawn; the poured copper is in the pictures)
+5V on Top Layer: 29.27,76.58 38.99,76.58 38.99,70.66 29.27,70.66
+5V on Top Layer: 30.99,68.25 33.18,68.25 33.18,65.71 30.97,65.71 30.97,66.33 32.4,66.33 32.4,67.62 30.98,67.62 30.98,68.24
+5V on Top Layer: 8.56,55.6 8.56,57.79 11.1,57.79 11.1,55.58 10.48,55.58 10.48,57.02 9.19,57.02 9.19,55.6 8.56,55.6
+5V on Top Layer: 38.86,78.03 38.86,77.27 38.74,77.27 38.48,77.01 38.48,75.87 38.61,75.74 38.85,75.74 38.85,74.47 31.36,74.47 31.36,76.45 36.03,76.45 37.49,77.9 38.1,77.9 38.23,78.03
+5V on Top Layer: 78.44,15.34 78.44,17.52 80.98,17.52 80.98,15.31 80.36,15.31 80.36,16.75 79.07,16.75 79.07,15.33 78.44,15.33
+5V on Top Layer: 9.19,56.87 9.19,52.6 9.55,52.25 9.55,50.83 7.38,50.83 7.42,55.04 8.56,56.19 8.56,56.87
+5V on Top Layer: 79.07,16.6 79.07,12.34 79.43,11.98 79.43,10.56 77.26,10.56 77.3,14.78 78.44,15.92 78.44,16.6
+5V on Top Layer: 32.24,67.57 27.97,67.57 27.62,67.21 26.2,67.21 26.2,69.38 30.41,69.34 31.55,68.2 32.24,68.2
+5V on Inner2: 0.26,99.74 99.74,99.74 99.74,0.26 0.26,0.26
GND on Top Layer: 65.66,84.89 65.66,89.33 75.69,99.37 96.24,99.37 79.68,84.89
GND on Top Layer: 38.99,78.03 38.99,77.27 38.74,77.01 38.61,77.01 38.61,75.87 40.64,75.87 40.64,77.01 39.61,77.01 39.61,78.02 39.62,78.03
GND on Top Layer: 35.62,76.85 31.4,76.85 30.23,78.03 30.23,80.19 36.96,80.19 36.96,78.19
GND on Top Layer: 79.25,16.56 80.14,16.56 80.14,15.28 80.64,14.78 82.12,14.78 82.12,12.59 80.81,12.59 80.81,10.56 80,10.56 80,11.87 79.25,12.62
GND on Top Layer: -9.65,104.44 114.43,104.44 114.43,-5.79 -9.65,-5.79
GND on Top Layer: 51.31,84.63 51.31,85.96 48.22,89.05 48.22,90.37 39.48,99.11 1.02,99.11 1.02,84.63
GND on Top Layer: 32.26,67.36 32.26,66.6 30.97,66.6 30.43,66.05 30.43,64.46 28.29,64.46 27.54,65.21 27.54,65.67 26.21,65.67 26.16,65.71 26.16,66.68 27.56,66.68 28.24,67.36
GND on Top Layer: 80.01,23.9 80.81,23.9 81.12,23.59 81.12,22.79 82.12,21.78 82.12,19.59 80.64,19.59 80.64,21.85 80.01,22.48
GND on Top Layer: 9.45,56.87 10.21,56.87 10.21,55.59 10.75,55.04 12.35,55.04 12.35,52.9 11.6,52.15 11.14,52.15 11.14,50.82 11.1,50.78 10.12,50.78 10.12,52.17 9.45,52.85
GND on Inner1: 0.26,99.74 99.74,99.74 99.74,0.26 0.26,0.26
VCC3V3 on Top Layer: 79.07,17.62 78.44,17.62 78.44,18.51 77.3,19.65 77.17,19.65 77.17,21.73 78.34,22.9 78.34,25.7 79.3,25.7 79.3,24.38 79.46,24.22 79.46,22.19 79.07,21.81
VCC3V3OUT on Top Layer: 9.19,57.89 8.56,57.89 8.56,58.78 7.42,59.92 7.29,59.92 7.29,62 8.46,63.17 8.46,65.97 9.42,65.97 9.42,64.65 9.58,64.49 9.58,62.46 9.19,62.08
VCC3V3OUT on Top Layer: 3.17,70.79 3.17,58 9.14,58 9.14,65.96 9.27,66.09 5.72,69.65 5.72,70.79
VCC3V3OUT on Top Layer: 18.54,71.93 18.54,70.79 10.45,70.79 7.51,67.85 5.72,69.65 5.59,69.65 7.87,71.93
VCCCAM on Top Layer: 33.27,69.19 37.3,69.21 42.93,70.92 45.34,70.92 45.97,70.28 45.97,69.01 45.39,68.43 41.9,68.47 41.23,67.22 39.53,67.22 39.32,67.01 37.89,67.01 37.3,67.6 33.27,67.6
VIN_BAT on Top Layer: 35.43,83.97 35.43,82.6 39.62,78.41 39.62,77.17 57.53,77.17 57.53,83.97
VIN_BAT on Top Layer: 87.2,90.09 88.39,90.09 88.39,84.87 80.66,77.14 80.26,77.14 80.26,84
VIN_BAT on Top Layer: 42.8,80.45 29.85,80.45 26.16,76.76 0.89,76.76 0.89,84 42.8,84
VIN_BAT on Top Layer: 56.77,84 80.26,84 80.26,77.17 56.77,77.17
33.10 on Top Layer: 24.76,32.89 24.76,34.23 27.5,34.23 27.5,32.89
A11 on Top Layer: 16,69.52 23.71,69.52 23.71,68.41 16,68.41
DCIN on Top Layer: 52.79,97.59 52.79,91.85 54.13,90.51 54.13,84.89 64.39,84.89 64.39,89.2 56.01,97.59
$1N441 on Top Layer: 40.37,75.71 40.37,74.96 39.88,74.47 39.88,73.36 41.22,73.36 41.22,74.38 40.77,74.83 40.77,75.7
$1N622 on Top Layer: 38.99,75.74 38.99,74.49 38.62,74.12 38.62,72.8 39.58,72.8 39.58,75.03 39.5,75.11 39.5,75.74 39.49,75.74
$1N622 on Top Layer: 36.04,74.05 39.58,74.05 39.58,72.8 36.04,72.8
$1N1315 on Top Layer: 79.85,27.44 80.98,27.44 80.98,24.25 79.85,24.25
$1N1939 on Top Layer: 43.81,97.71 43.81,95.43 48.77,90.47 48.77,89.04 52.16,89.04 52.2,89.08 52.2,90.29 47.08,95.41 47.08,97.62 46.99,97.71
$1N4409 on Top Layer: 28.35,32.91 28.35,35.56 29.46,35.56 29.46,32.91
$1N4417 on Top Layer: 24.76,34.42 24.76,35.66 27.24,35.66 27.24,34.42

Small or netless copper shapes (teardrops, artwork), in the pictures only: 93 on Top Layer, 78 on Bottom Layer

## Text on the board
Top Silkscreen Layer: GND | 20.11 | 20.14 | 20.12 | 20.13 | 11.10 | 11.9 | 11.11 | 11.12 | 13.0 | 13.1 | 13.2 | 13.3 | 3.3V | 15.3 | 15.5 | 15.0 | 15.2 | 15.4 | 15.1 | 5V | 22.1 | 22.2 | 22.3 | 22.0 | 15.8 | 23.1 | 14.6 | 14.5 | 14.4 | 14.3 | 14.2 | 14.1 | 14.0 | 屏幕接口 | 姿态传感器接口 | 11.6 | 10.6 | 10.2 | 10.5 | PWM波接口 | 编码器接口 | 33.12 | 33.13 | 33.11 | A6 | A4 | A2 | A0 | 33.8 | 21.2 | 21.3 | 21.4 | 21.5 | 33.6 | 33.7 | wifi模块接口 | 10.3 | 10.1 | 02.6 | 02.7 | 02.4 | 02.5 | 33.9 | 无线串口
